# Altium schematic sheet EVK-NORA-W1_SCHEM_0000_Topsheet.SchDoc
size B; Date: 7/24/2020; CompanyName: U-Blox; DrawnBy: EMOO; Engineer: EMOO; Organization: U-Blox; Address1: 3950 Fairview Industrial Dr SE #100; Address2: Salem, OR 97302; SheetNumber: 1; SheetTotal: 6; SheetSize: B; SheetTitle: TopSheet
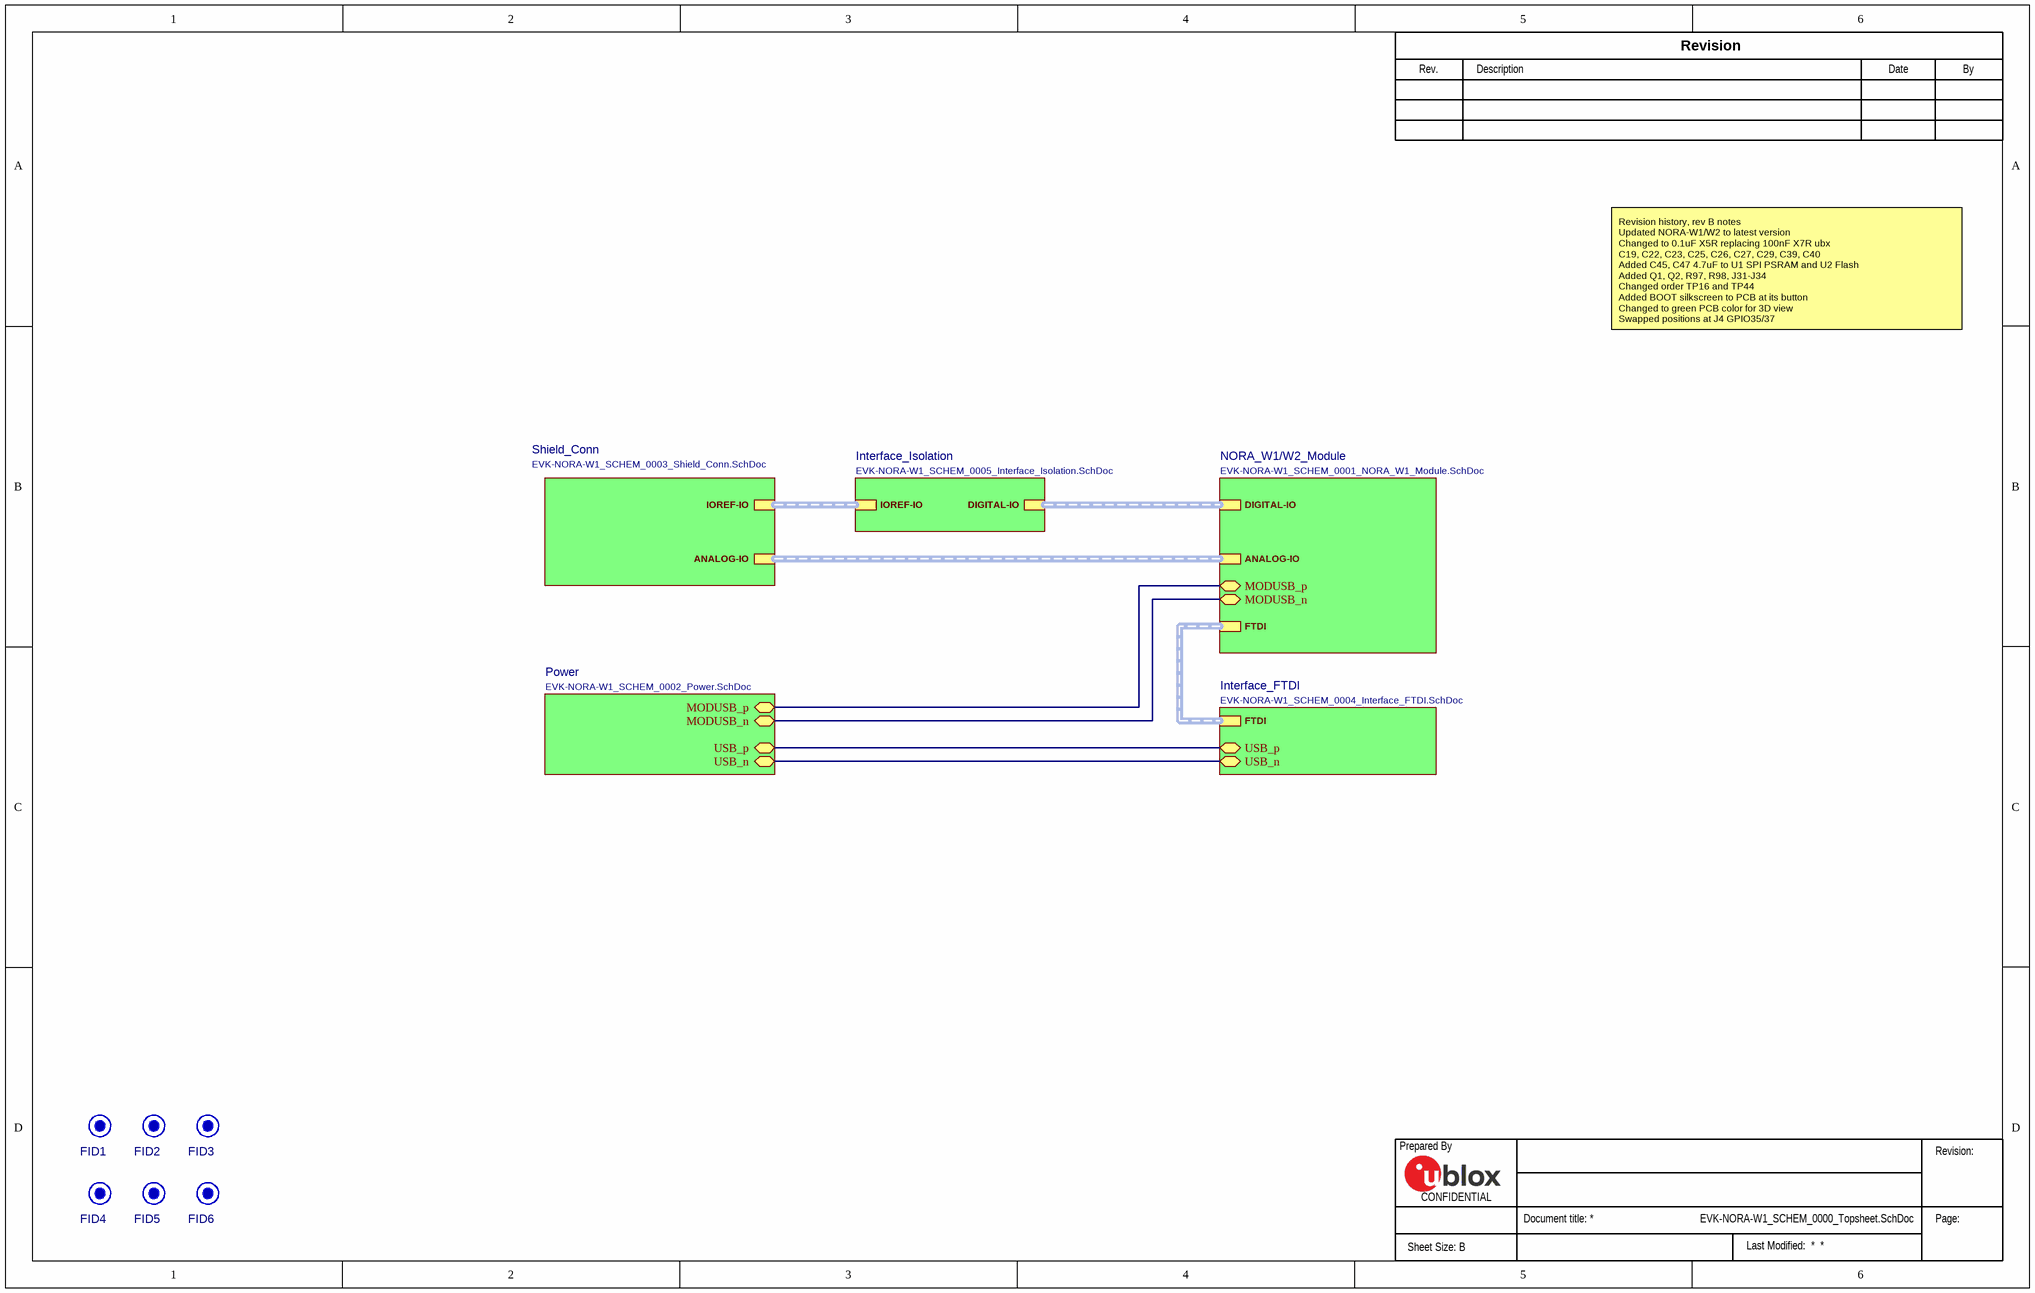
[diagram p0: EVK-NORA-W1_SCHEM_0000_Topsheet.SchDoc]

## Parts
(Parts that share a designator on the sheet are numbered #1, #2 ... from top to bottom, then left to right.)
?#1  (no value)  (graphical)
?#2  (no value)  (graphical)
FID1  FID  [FIDUCIAL40]  (value not drawn)  (no BOM)
FID2  FID  [FIDUCIAL40]  (value not drawn)  (no BOM)
FID3  FID  [FIDUCIAL40]  (value not drawn)  (no BOM)
FID4  FID  [FIDUCIAL40]  (value not drawn)  (no BOM)
FID5  FID  [FIDUCIAL40]  (value not drawn)  (no BOM)
FID6  FID  [FIDUCIAL40]  (value not drawn)  (no BOM)

## Sub-sheets
Interface_FTDI = EVK-NORA-W1_SCHEM_0004_Interface_FTDI.SchDoc: FTDI (harness FTDI), USB_p (bidir), USB_n (bidir)
Interface_Isolation = EVK-NORA-W1_SCHEM_0005_Interface_Isolation.SchDoc: DIGITAL-IO (harness DIGITAL-IO), IOREF-IO (harness IOREF-IO)
NORA_W1/W2_Module = EVK-NORA-W1_SCHEM_0001_NORA_W1_Module.SchDoc: FTDI (harness FTDI), DIGITAL-IO (harness DIGITAL-IO), ANALOG-IO (harness ANALOG-IO), MODUSB_p (bidir), MODUSB_n (bidir)
Power = EVK-NORA-W1_SCHEM_0002_Power.SchDoc: USB_p (bidir), MODUSB_p (bidir), MODUSB_n (bidir), USB_n (bidir)
Shield_Conn = EVK-NORA-W1_SCHEM_0003_Shield_Conn.SchDoc: IOREF-IO (harness IOREF-IO), ANALOG-IO (harness ANALOG-IO)

## Nets
(unnamed): sheet NORA_W1/W2_Module/MODUSB_p, sheet Power/MODUSB_p
(unnamed): sheet NORA_W1/W2_Module/MODUSB_n, sheet Power/MODUSB_n
(unnamed): sheet Interface_FTDI/USB_p, sheet Power/USB_p
(unnamed): sheet Interface_FTDI/USB_n, sheet Power/USB_n

## Buses and harness runs
harness sheet Interface_FTDI/FTDI = sheet NORA_W1/W2_Module/FTDI
harness sheet Interface_Isolation/DIGITAL-IO = sheet NORA_W1/W2_Module/DIGITAL-IO
harness sheet Interface_Isolation/IOREF-IO = sheet Shield_Conn/IOREF-IO
harness sheet NORA_W1/W2_Module/ANALOG-IO = sheet Shield_Conn/ANALOG-IO

## Notes on the sheet
- Revision history, rev B notes
  Updated NORA-W1/W2 to latest version
  Changed to 0.1uF X5R replacing 100nF X7R ubx
  C19, C22, C23, C25, C26, C27, C29, C39, C40
  Added C45, C47 4.7uF to U1 SPI PSRAM and U2 Flash
  Added Q1, Q2, R97, R98, J31-J34
  Changed order TP16 and TP44
  Added BOOT silkscreen to PCB at its button
  Changed to green PCB color for 3D view
  Swapped positions at J4 GPIO35/37
- Rev.
- Description
- Revision
- Date
- By
- Prepared By
- Revision:
- CONFIDENTIAL
- Page:

## Library data of the parts
?#1 = Top_Revision_Block: Release Revision History Block
?#2 = Top_Title_Block: Top level schematic title block for top level sheet
FID1-FID6 = FIDUCIAL.04: Fiducial, 0.040" inner Dia, 0.075" outer Dia; Added By: Jeremy D; Part Number: FIDUCIAL.04; Size: 0.040"; Height: 0; DNP: DNP; Added Date: 2/1/2015; Checked By: Paul B; Checked Date: 2/5/2015